# EAGLE design LMP91000 (EAGLE 9.2.2)
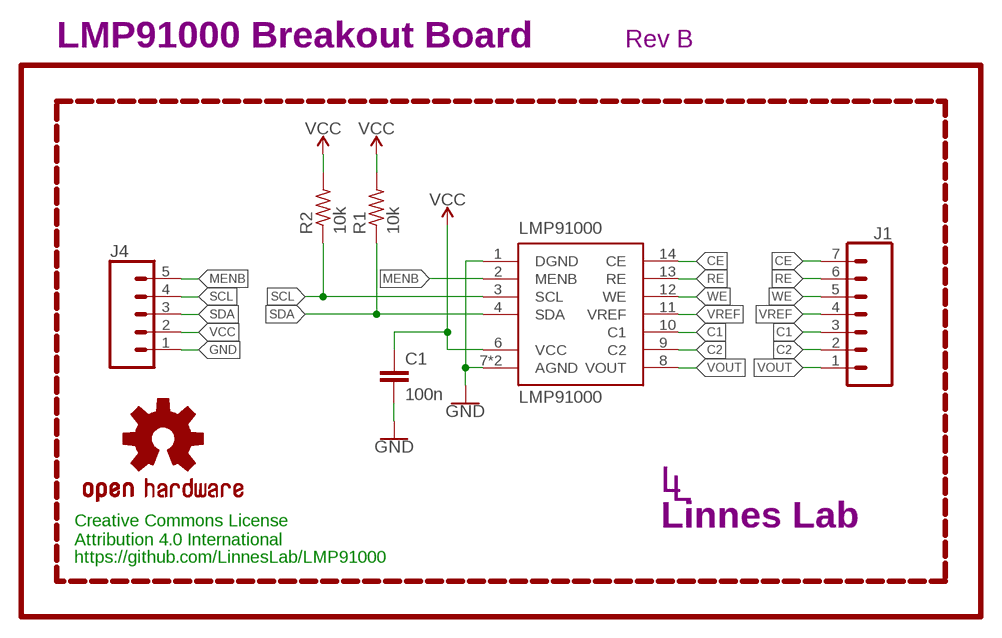
[diagram p0: schematic, sheet 1]

## Parts
C1  100n  CAPACITOR0402  [C0402]
J1  CONN_07NO_SILK  [1X07_NO_SILK]
J4  CONN_05NO_SILK  [1X05_NO_SILK]
LMP91000  LMP91000  [WSON-14]
LOGO1  OSHW-LOGOS  [OSHW-LOGO-S]
R1  10k  RESISTOR0402-BIGGER  [R0402-BIGGER]
R2  10k  RESISTOR0402-BIGGER  [R0402-BIGGER]
U$1  LINNES.LAB.05  [LINNES.LAB.05]
U$2  LINNES.LAB.LOGO  [LINNES.LAB.LOGO]
U$3  REVISION.B  [REV.B]

## Nets
C1: J1.3 LMP91000.10(C1)
C2: J1.2 LMP91000.9(C2)
CE: J1.7 LMP91000.14(CE)
GND: C1.2 J4.1 LMP91000.1(DGND) LMP91000.7(AGND) LMP91000.DAP(AGND)
MENB: J4.5 LMP91000.2(MENB)
RE: J1.6 LMP91000.13(RE)
SCL: J4.4 LMP91000.3(SCL) R2.1
SDA: J4.3 LMP91000.4(SDA) R1.1
VCC: C1.1 J4.2 LMP91000.6(VCC) R1.2 R2.2
VOUT: J1.1 LMP91000.8(VOUT)
VREF: J1.4 LMP91000.11(VREF)
WE: J1.5 LMP91000.12(WE)

## Notes on the sheet
- LMP91000 Breakout Board
- Creative Commons License
  Attribution 4.0 International
- https://github.com/LinnesLab/LMP91000

## Library data of the parts
C1 = LinnesLab-Passives:CAPACITOR
J1 = LinnesLab-Connectors:CONN_07: Multi connection point. Often used as Generic Header-pin footprint for 0.1 inch spaced/style header connections On any of the 0.1 inch spaced packages, you can populate with these: Break Away Headers - Straight <https://www.sparkfun.com/products/116> (PRT-00116) Break Away Male Headers - Right Angle <https://www.sparkfun.com/products/553> (PRT-00553) Female Headers <https://www.sparkfun.com/products/115> (PRT-00115) Break Away Headers - Machine Pin <https://www.sparkfun.com/products/117> (PRT-00117) Break Away Female Headers - Swiss Machine Pin <https://www.sparkfun.com/products/743> (PRT-00743) For SCREWTERMINALS and SPRING TERMINALS visit here: Screw Terimnals on SparkFun.com <https://www.sparkfun.com/search/results?term=Screw+Terminals> (5mm/3.5mm/2.54mm spacing) This device is also useful as a general connection point to wire up your design to another part of your project. Our various solder wires solder well into these plated through hole pads. Hook-Up Wire - Assortment (Stranded, 22 AWG) <https://www.sparkfun.com/products/11375> (PRT-11375) Hook-Up Wire - Assortment (Solid Core, 22 AWG) <https://www.sparkfun.com/products/11367> (PRT-11367) View the entire wire category on our website here <https://www.sparkfun.com/categories/141> Special notes: Molex polarized connector foot print use with SKU : PRT-08231 with associated crimp pins and housings. 1MM SMD Version SKU: PRT-10208 NOTES ON THE VARIANTS LOCK and LOCK_LONGPADS... This footprint was designed to help hold the alignment of a through-hole component (i.e. 6-pin header) while soldering it into place. You may notice that each hole has been shifted either up or down by 0.005 of an inch from it's more standard position (which is a perfectly straight line). This slight alteration caused the pins (the squares in the middle) to touch the edges of the holes. Because they are alternating, it causes a "brace" to hold the component in place. 0.005 has proven to be the perfect amount of "off-center" position when using our standard breakaway headers. Although looks a little odd when you look at the bare footprint, once you have a header in there, the alteration is very hard to notice. Also,if you push a header all the way into place, it is covered up entirely on the bottom side.
J4 = LinnesLab-Connectors:CONN_05: Multi connection point. Often used as Generic Header-pin footprint for 0.1 inch spaced/style header connections On any of the 0.1 inch spaced packages, you can populate with these: Break Away Headers - Straight <https://www.sparkfun.com/products/116> (PRT-00116) Break Away Male Headers - Right Angle <https://www.sparkfun.com/products/553> (PRT-00553) Female Headers <https://www.sparkfun.com/products/115> (PRT-00115) Break Away Headers - Machine Pin <https://www.sparkfun.com/products/117> (PRT-00117) Break Away Female Headers - Swiss Machine Pin <https://www.sparkfun.com/products/743> (PRT-00743) For SCREWTERMINALS and SPRING TERMINALS visit here: Screw Terimnals on SparkFun.com <https://www.sparkfun.com/search/results?term=Screw+Terminals> (5mm/3.5mm/2.54mm spacing) This device is also useful as a general connection point to wire up your design to another part of your project. Our various solder wires solder well into these plated through hole pads. Hook-Up Wire - Assortment (Stranded, 22 AWG) <https://www.sparkfun.com/products/11375> (PRT-11375) Hook-Up Wire - Assortment (Solid Core, 22 AWG) <https://www.sparkfun.com/products/11367> (PRT-11367) View the entire wire category on our website here <https://www.sparkfun.com/categories/141> Special notes: Molex polarized connector foot print use with SKU : PRT-08231 with associated crimp pins and housings. 1MM SMD Version SKU: PRT-10208
LMP91000 = LinnesLab-Sensors:LMP91000: Integrated Potentiostat for Electrochemical Measurements of Gases and Fluids from Texas Instruments.
LOGO1 = LinnesLab-Logos:OSHW-LOGO: Open-Source Hardware (OSHW) Logo This logo indicates the piece of hardware it is found on incorporates a OSHW license and/or adheres to the definition of open source hardware found here: http://freedomdefined.org/OSHW
R1 R2 = LinnesLab-Passives:RESISTOR
U$1 = LinnesLab-Logos:LINNES.LAB
U$2 = LinnesLab-Logos:LINNES.LAB.LOGO
U$3 = LinnesLab-Logos:REVISION.B

## Board
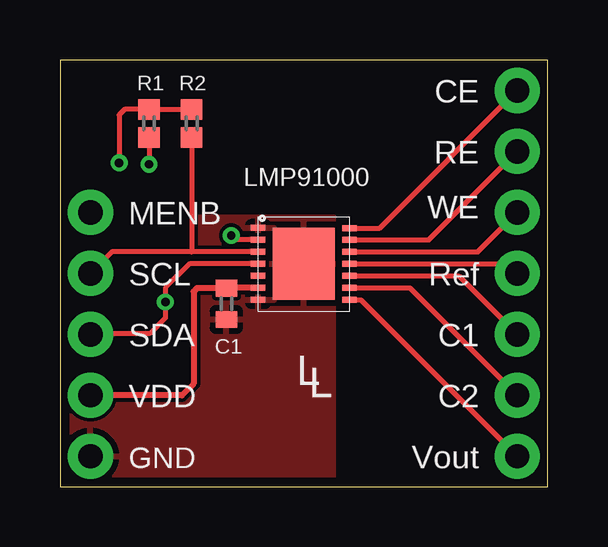
[diagram p1: board, top side]
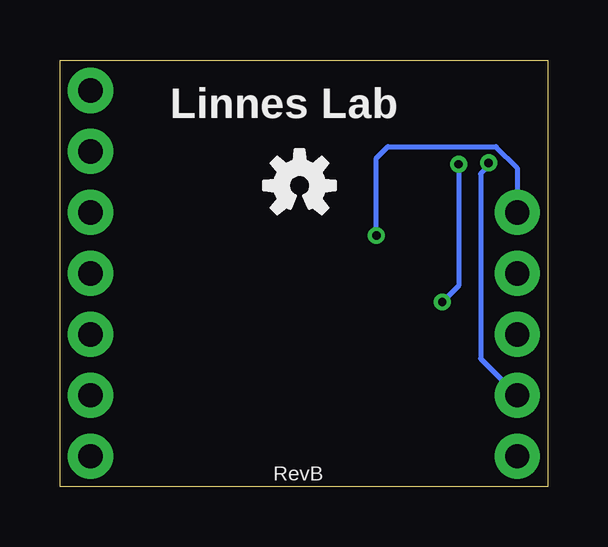
[diagram p2: board, bottom side, seen from below]

Size 20.32 x 17.78 mm. Coordinates in mm from the lower left corner, seen from the top.
Outline: 0,0 20.32,0 20.32,17.78 0,17.78 0,0
Copper layers (1*16): Top 0.0356mm / dielectric 1.5011mm / Bottom 0.0356mm
Design rules "LaenPCBOrder": minimum track width 6mil, minimum drill 13mil, track to track 6mil, track to pad 6mil, pad to pad 6mil, via to via 6mil, smd to smd 6mil, copper to edge 15mil, drill to drill 6mil, minimum pad ring 7mil, minimum via ring 7mil, stop-mask expansion 3mil, vias tented up to drill 0mil, thermal gap 10mil

### Footprints (pad centres in the part's own frame; a part is rotated, then mirrored left to right if it is on the bottom)
C0402 = smd 0.7 x 0.9: 1 -0.65,0; 2 0.65,0
1X07_NO_SILK = drill 1.016 pad 1.88: 1 0,0; 2 2.54,0; 3 5.08,0; 4 7.62,0; 5 10.16,0; 6 12.7,0; 7 15.24,0
1X05_NO_SILK = drill 1.016 pad 1.88: 1 0,0; 2 2.54,0; 3 5.08,0; 4 7.62,0; 5 10.16,0
WSON-14 = smd 0.6 x 0.25: 1 0,3.5; 2 0,3; 3 0,2.5; 4 0,2; 5 0,1.5; 6 0,1; 7 0,0.5; 8 3.8,0.5; 9 3.8,1; 10 3.8,1.5; 11 3.8,2; 12 3.8,2.5; 13 3.8,3; 14 3.8,3.49 | smd 2.6 x 3: DAP 1.9,2.008
R0402-BIGGER = smd 0.85 x 0.9: 1 -0.58,0; 2 0.58,0

### Placement (x,y rotation side)
C1  6.93,7.62 270 top
J1  19.05,1.27 90 top
J4  1.27,1.27 90 top
LMP91000  8.26,7.29 0 top
LOGO1  10.34,12.55 0 bottom
R1  3.71,15.14 90 top
R2  5.49,15.14 90 top
U$1  15.75,15.34 0 bottom
U$2  9.86,4.22 0 top
U$3  11.43,0.25 0 bottom

### Tracks (layer width: path | path; a pad name or v marks a point on that pad's centre or on a via)
C1
  Top 0.203: LMP91000.10 16.61,8.79 J1.3
C2
  Top 0.203: LMP91000.9 14.57,8.29 J1.2
CE
  Top 0.203: LMP91000.14 13.32,10.78 J1.7
GND
  pour Top: 0.33,11.28 11.43,11.28 11.43,0.41 0.33,0.41
MENB  (via drill 0.35)
  Top 0.203: LMP91000.2 7.32,10.29 v7.14,10.47
  Bottom 0.203: v7.14,10.47 7.14,13.69 6.66,14.17 2.16,14.17 1.27,13.28 J4.5
RE
  Top 0.203: LMP91000.13 15.37,10.29 J1.6
SCL
  Top 0.203: LMP91000.3 5.49,9.79 | 5.49,9.79 2.17,9.79 J4.4 | R2.1 5.49,9.79
SDA  (via drill 0.35)
  Top 0.203: v4.39,7.7 4.39,7.72 | v4.39,7.7 4.39,7.04 3.73,6.38 1.29,6.38 J4.3 | R1.1 v3.71,13.44 | LMP91000.4 5.4,9.29 4.39,8.28 v4.39,7.7
  Bottom 0.203: v3.71,13.44 3.71,8.38 v4.39,7.7
VCC  (via drill 0.35)
  Top 0.203: v2.46,13.49 2.46,15.49 2.69,15.72 R1.2 R2.2
  Top 0.254: J4.2 5.08,3.81 5.56,4.29 5.56,8.13 5.71,8.27 C1.1 6.95,8.29 LMP91000.6
  Bottom 0.203: v2.46,13.49 2.46,13.36 2.79,13.03 2.79,5.33 J4.2
VOUT
  Top 0.203: LMP91000.8 12.53,7.79 J1.1
VREF
  Top 0.203: LMP91000.11 18.65,9.29 J1.4
WE
  Top 0.203: LMP91000.12 17.41,9.79 J1.5

### Text on the board
tPlace: CE | RE | MENB | WE | SCL | Ref | SDA | C1 | VDD | C2 | GND | Vout